# Altium schematic sheet Power.SchDoc
size A4; SheetNumber: 2; SheetTotal: 7
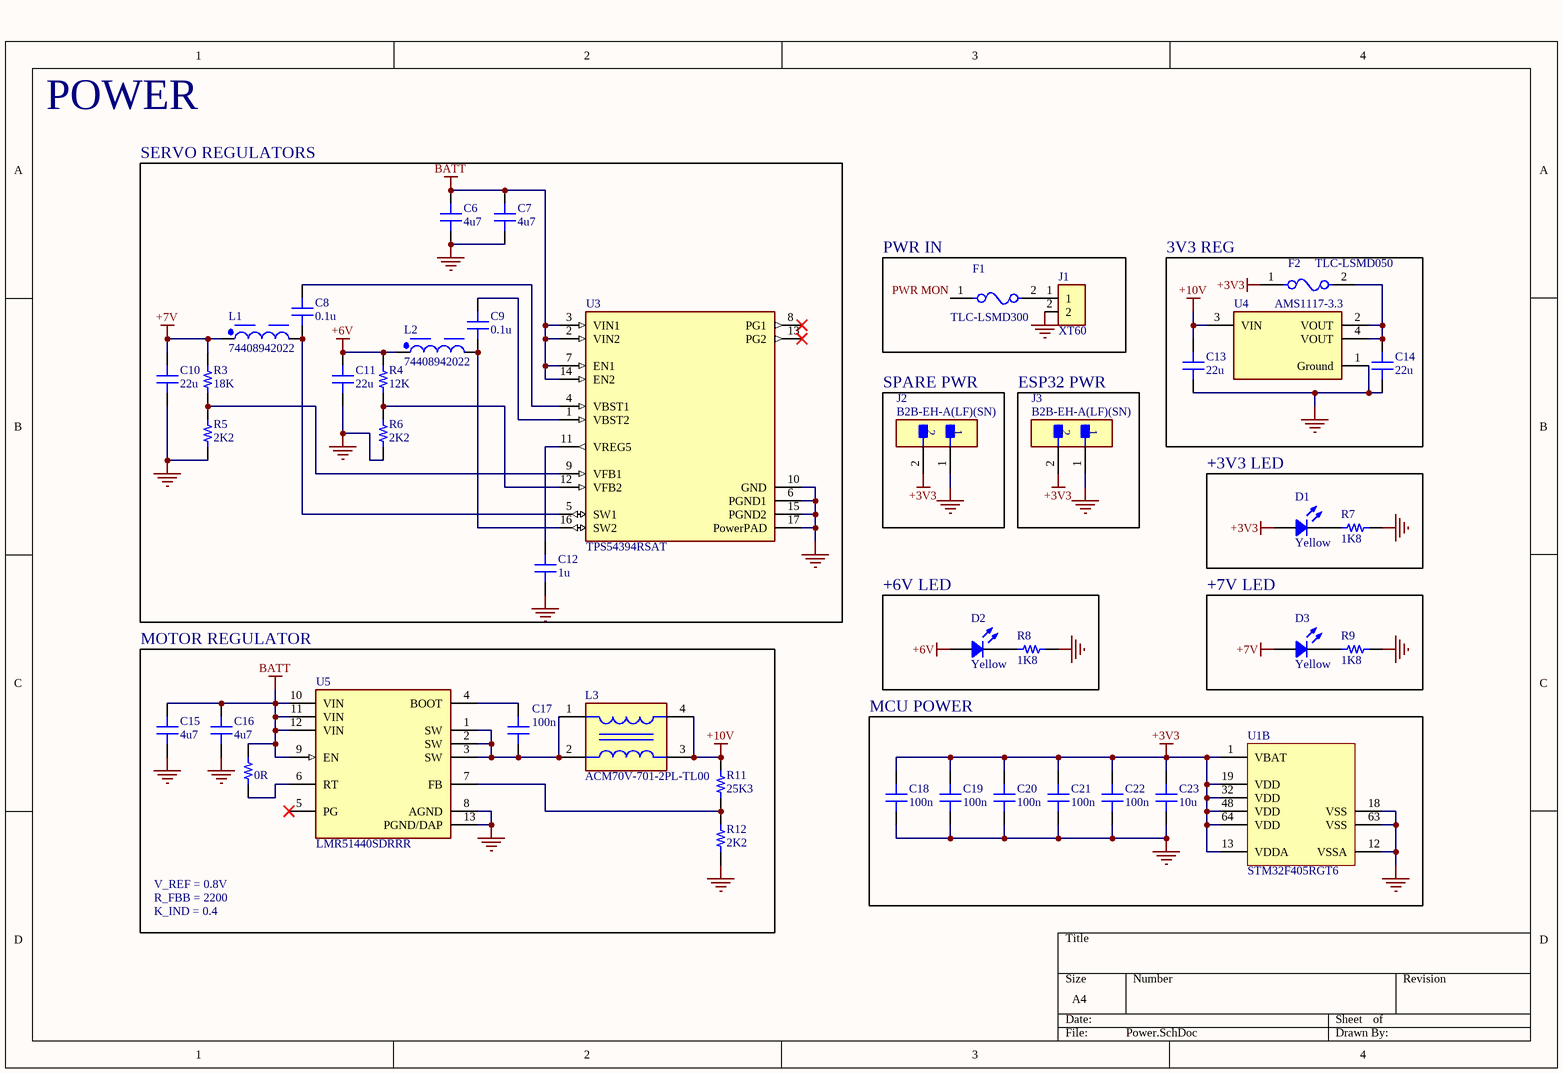
[diagram p0: Power.SchDoc]

## Parts
?  0R  [RES 0402_1005]
C6  4u7  [CAP 0805_2012]
C7  4u7  [CAP 0805_2012]
C8  0.1u  [CAP 0805_2012]
C9  0.1u  [CAP 0805_2012]
C10  22u  [CAP 0805_2012]
C11  22u  [CAP 0805_2012]
C12  1u  [CAP 0402_1005]
C13  22u  [CAP 0603_1608]
C14  22u  [CAP 0603_1608]
C15  4u7  [CAP 0805_2012]
C16  4u7  [CAP 0805_2012]
C17  100n  [CAP 0402_1005]
C18  100n  [CAP 0402_1005]
C19  100n  [CAP 0402_1005]
C20  100n  [CAP 0402_1005]
C21  100n  [CAP 0402_1005]
C22  100n  [CAP 0402_1005]
C23  10u  [CAP 0603_1608]
D1  Yellow  [LED 1206_3216 YELLOW]
D2  Yellow  [LED 1206_3216 YELLOW]
D3  Yellow  [LED 1206_3216 YELLOW]
F1  TLC-LSMD300  [FP-2920L-MFG]
F2  TLC-LSMD050  [FP-2920L-MFG]
J1  XT60  [AMASS_XT60PB-M]
J2  B2B-EH-A(LF)(SN)  [FP-B2B-EH-A_LF_SN-MFG]
J3  B2B-EH-A(LF)(SN)  [FP-B2B-EH-A_LF_SN-MFG]
L1  74408942022  [WE-SPC_4828]
L2  74408942022  [WE-SPC_4828]
L3  ACM70V-701-2PL-TL00  [FP-ACM70V-MFG]
R3  18K  [RES 0805_2012]
R4  12K  [RES 0805_2012]
R5  2K2  [RES 0805_2012]
R6  2K2  [RES 0805_2012]
R7  1K8  [RES 0402_1005]
R8  1K8  [RES 0402_1005]
R9  1K8  [RES 0402_1005]
R11  25K3  [RES 0805_2012]
R12  2K2  [RES 0805_2012]
U1  STM32F405RGT6  [STM-LQFP64_M]  (part B of 2)
U3  TPS54394RSAT  [FP-RSA0016B-IPC_B]
U4  AMS1117-3.3  [FP-AMS1117-IPC_C]
U5  LMR51440SDRRR  [FP-DRR0012G-IPC_A]

## Blocks framed on the sheet
SERVO REGULATORS: C6-C12 L1 L2 R3-R6 U3
PWR IN: F1 J1
3V3 REG: C13 C14 F2 U4
SPARE PWR: J2
ESP32 PWR: J3
+3V3 LED: D1 R7
+6V LED: D2 R8
+7V LED: D3 R9
MOTOR REGULATOR: ? C15-C17 L3 R11 R12 U5
MCU POWER: C18-C23 U1

## Nets
+3V3: C18.2 C19.2 C20.2 C21.2 C22.2 C23.2 D1.1 F2.1 J2.2 J3.2 U1.1(VBAT) U1.13(VDDA) U1.19(VDD) U1.32(VDD) U1.48(VDD) U1.64(VDD)
+6V: C11.2 D2.1 L2.1 R4.2
+7V: C10.2 D3.1 L1.1 R3.2
+10V: C13.2 L3.3 L3.4 R11.2 U4.3(VIN)
BATT: ?.2 C6.2 C7.2 C15.2 C16.2 U3.2(VIN2) U3.3(VIN1) U3.7(EN1) U3.14(EN2) U5.9(EN) U5.10(VIN) U5.11(VIN) U5.12(VIN)
GND: C6.1 C7.1 C10.1 C11.1 C12.1 C13.1 C14.1 C15.1 C16.1 C18.1 C19.1 C20.1 C21.1 C22.1 C23.1 J1.2 J2.1 J3.1 R5.1 R6.1 R7.2 R8.2 R9.2 R12.1 U1.12(VSSA) U1.18(VSS) U1.63(VSS) U3.6(PGND1) U3.10(GND) U3.15(PGND2) U3.17(PowerPAD) U4.1(Ground) U5.8(AGND) U5.13(PGND/DAP)
PWR MON: F1.1
Net?_1: ?.1 U5.6(RT)
NetC8_1: C8.1 L1.2 U3.5(SW1)
NetC8_2: C8.2 U3.4(VBST1)
NetC9_1: C9.1 L2.2 U3.16(SW2)
NetC9_2: C9.2 U3.1(VBST2)
NetC12_2: C12.2 U3.11(VREG5)
NetC14_2: C14.2 F2.2 U4.2(VOUT) U4.4(VOUT)
NetC17_1: C17.1 L3.1 L3.2 U5.1(SW) U5.2(SW) U5.3(SW)
NetC17_2: C17.2 U5.4(BOOT)
NetD1_2: D1.2 R7.1
NetD2_2: D2.2 R8.1
NetD3_2: D3.2 R9.1
NetF1_2: F1.2 J1.1
NetR3_1: R3.1 R5.2 U3.9(VFB1)
NetR4_1: R4.1 R6.2 U3.12(VFB2)
NetR11_1: R11.1 R12.2 U5.7(FB)

Not connected (* = marked no-connect by the designer): U3 8(PG1)* 13(PG2)*; U5 5(PG)*

## Notes on the sheet
- POWER
- V_REF = 0.8V
- R_FBB = 2200
- K_IND = 0.4

## Library data of the parts
? = 5112: 0402 JUMPER ON TAPE AND REEL; Part Number: 5112
C6-C11 C15 C16 = CBR08C330JAGAC: CAP CER 33PF 250V C0G/NP0 0805; manufacturer: KEMET; Temperature Coefficient: C0G, NP0; Tolerance: ±5%; Part Number: CBR08C330JAGAC; Applications: RF, Microwave, High Frequency; Capacitance: 33 pF; componentlink1description: Datasheet; componentlink1url: https://api.kemet.com/component-edge/download/datasheet/CBR08C330JAGAC.pdf; componentlink2description: DigiKey Link; componentlink2url: https://www.digikey.com/en/products/detail/kemet/CBR08C330JAGAC/2732330; Device Package: 0805 (2012 Metric); Features: High Q, Low Loss, Ultra Low ESR; lastupdated: 8/02/2024 8:16:33 PM; Lifecycle Status: Active; Minimum Order: 1; Mounting Type: Surface Mount, MLCC; Operating Temperature: -55°C ~ 125°C; Package / Case: 0805 (2012 Metric); packaging: TapeAndReel; partid: 2409; Part Status: Active; price: 0.36; series: CBR-SMD RF C0G; Size / Dimension: 0.079" L x 0.049" W (2.00mm x 1.25mm); Supplier 1: DigiKey; Supplier Part Number 1: 399-6202-1-ND; Thickness (Max): 0.037" (0.95mm); Voltage - Rated: 250V
  C6 C7 C15 C16: Value: 4u7
  C8 C9: Value: 0.1u
  C10 C11: Value: 22u
C12 C17-C22 = CL05B104KP5VPNC: CAP CER 100NF 10V X7R 0402; manufacturer: Samsung Electro-Mechanics; Capacitance: 0.1 µF; Tolerance: ±10%; Part Number: CL05B104KP5VPNC; Applications: Automotive; componentlink1description: Datasheet; componentlink1url: https://mm.digikey.com/Volume0/opasdata/d220001/medias/docus/5458/CL05B104KP5VPNC_Spec.pdf; componentlink2description: DigiKey Link; componentlink2url: https://www.digikey.com/en/products/detail/samsung-electro-mechanics/CL05B104KP5VPNC/20498482; Device Package: 0402 (1005 Metric); lastupdated: 29/01/2024 8:03:07 PM; Lifecycle Status: Active; Minimum Order: 1; Mounting Type: Surface Mount, MLCC; Operating Temperature: -55°C ~ 125°C; Package / Case: 0402 (1005 Metric); packaging: TapeAndReel; partid: 56690; price: 0.01; Ratings: AEC-Q200; series: CL; Size / Dimension: 0.039" L x 0.020" W (1.00mm x 0.50mm); Supplier 1: DigiKey; Supplier Part Number 1: 1276-CL05B104KP5VPNCCT-ND; Temperature Coefficient: X7R; Thickness (Max): 0.022" (0.55mm); Voltage - Rated: 10V
  C12: Value: 1u
  C17-C22: Value: 100n
C13 C14 = CL10A226MPCNUBE: CAP CER 22UF 10V X5R 0603; Part Number: CL10A226MPCNUBE
C23 = GRM188R60J106ME47D: CAP CER 10UF 6.3V X5R 0603; manufacturer: Murata Electronics; Capacitance: 10 µF; Tolerance: ±20%; Part Number: GRM188R60J106ME47D; Value: 10u; Applications: General Purpose; componentlink1description: Datasheet; componentlink1url: https://www.murata.com/~/media/webrenewal/support/library/catalog/products/capacitor/mlcc/c02e.ashx?la=en-us; componentlink2description: DigiKey Link; componentlink2url: https://www.digikey.com/en/products/detail/murata-electronics/GRM188R60J106ME47D/965910; Device Package: 0603 (1608 Metric); lastupdated: 29/01/2024 8:10:03 PM; Lifecycle Status: Active; Minimum Order: 1; Mounting Type: Surface Mount, MLCC; Operating Temperature: -55°C ~ 85°C; Package / Case: 0603 (1608 Metric); packaging: TapeAndReel; partid: 2351; Part Status: Active; price: 0.02; series: GRM; Size / Dimension: 0.063" L x 0.031" W (1.60mm x 0.80mm); Supplier 1: DigiKey; Supplier Part Number 1: 490-3896-1-ND; Temperature Coefficient: X5R; Thickness (Max): 0.035" (0.90mm); Voltage - Rated: 6.3V
D1-D3 = 5990240007F: LED YELLOW 1206 SMD; Manufacturer: Dialight; Configuration: Standard; Current - Test: 20mA; Lens Color: 0.80mm; Lens Size: 2.00mm x 1.60mm; Lens Style: Rectangle with Flat Top; Millicandela Rating: 126mcd; Viewing Angle: 140°; Voltage - Forward (Vf) (Typ): 2.1V; Wavelength - Dominant: 590nm; Part Number: 5990240007F; Color: Yellow; ComponentLink1Description: Datasheet; ComponentLink1URL: http://www.dialightsignalsandcomponents.com/Assets/Brochures_And_Catalogs/Indication/CBI_SMD_new/Dialight_CBI_data_599-1206_Apr2018.pdf; ComponentLink2Description: DigiKey Link; ComponentLink2URL: https://www.digikey.com/en/products/detail/dialight/5990240007F/9385418; Device Package: 1206 (3216 Metric); Height (Max): 0.80mm; LastUpdated: 27/01/2024 9:27:52 PM; Lifecycle Status: Active; Minimum Order: 1; Mounting Type: Surface Mount; Package / Case: 1206 (3216 Metric); Packaging: TapeAndReel; PartId: 1; Part Status: Active; Price: 0.04; Series: 599; Size / Dimension: 3.20mm L x 1.60mm W; Supplier 1: DigiKey; Supplier Part Number 1: 350-4363-1-ND; Supplier Device Package: 1206; Value: Yellow
F1 F2 = CMP-2000-05550-2: PTC RESET FUSE 15V 3A 2920; Manufacturer: Littelfuse; Manufacturer Part Number: 2920L300/15DR; Current Rating: 40A; Trip Current: 5A; Trip Time: 20s; Resistance: 0.015-0.048Ω; Value: 0.015-0.048Ω; Device Class L3: unset; Temperature: -40°C to +85°C; ComponentLink2Description: Datasheet; Temperature Range High: +85°C; Digikey Description: PTC RESET FUSE 15V 3A 2920; Lead Free: Yes; Height: 1.25mm; Voltage Rating: 15V; Package: 2920L; Temperature Range Low: -40°C; Ambient Temperature Range High: +85°C; RoHS: TRUE; Ambient Temperature Range Low: -40°C; Device Class L2: PTC Resettable Fuses; Category: Fuse; Automotive: No; ComponentLink2URL: https://m.littelfuse.com/~/media/electronics/datasheets/resettable_ptcs/littelfuse_ptc_2920l_datasheet.pdf.pdf; Device Class L1: Circuit Protection; Hold Current: 3A; Octopart: https://octopart.com/2920l300%2F15dr-littelfuse-673797
J1 = XT60_YELLOW: Power connector; 65A; PIN: 2; Colour: yellow; MP: XT60 YELLOW; MF: Pololu; SnapEDA_Link: https://www.snapeda.com/parts/XT60%20YELLOW/Pololu/view-part/?ref=snap; Availability: Not in stock; Package: None; Check_prices: https://www.snapeda.com/parts/XT60%20YELLOW/Pololu/view-part/?ref=eda; Value: *; Price: None
J2 J3 = CMP-17439-000026-1: CONN HEADER VERT 2POS 2.5MM; Number of Contacts: 2; Current Rating: 3A; Connector Type: Plug; Contact Resistance: 20mR; Gender: Male; Voltage Rating: 250V; Fastening Type: Detent; Depth: 3.8mm; Max Operating Temperature: 85°C; Orientation: Straight; Series: EH; Contact Plating: Tin; Min Operating Temperature: -25°C; Contact Type: Male Pin; Housing Color: White; Termination: Press-Fit; Housing Material: Nylon; Pitch: 2.5mm; Number of Positions: 2; Max Current Rating: 3A; Packaging: Bulk; Lead Free: Lead Free; Number of Rows: 1; Length: 7.5mm; Contact Mating Length: 0.13inch; Color: Natural; Max Voltage Rating (AC): 250V; Contact Material: Copper Alloy; Mount: Through Hole
L1 L2 = CMP-1401-00021-2: NexarPartId: 23392467; Self Resonant Frequency: 54MHz; RMS Current (Irms): 2.5A; Shielding: Shielded; Test Frequency: 100kHz; Max DC Current: 4A; Inductance: 2.2µH; DC Resistance (DCR): 38mΩ; Core Material: Ferrite; Inductance Tolerance: 20%; Case/Package: 4828; Case Code (Metric): 4848; Length: 4.8mm; Mount: Surface Mount; Max Operating Temperature: 125°C; Ambient Temperature Range High: 85°C; Case Code (Imperial): 1919; Ambient Temperature Range Low: -40°C; Number of Pins: 2; Current Rating: 2.5A; REACH SVHC: Unknown; Height: 2.8mm; Saturation Current: 4A; Width: 4.8mm; RoHS: Compliant; Termination: SMD/SMT; Tolerance: 20%; Min Operating Temperature: -40°C; Packaging: Digi-Reel®
L3 = CMP-08256-000005-1: CMC 4A 2LN 700 OHM SMD AEC-Q200; Manufacturer: TDK; Automotive Grade: Grade 1; Series Resistance: 15mΩ; Shielding: true; Impedance At Frequency: 700Ω @ 100MHz; Device Class L3: Common Mode Chokes; Temperature: -40°C to +125°C; Automotive: Yes; Mouser Description: Ind Common Mode Filter Shielded Wirewound 700Ohm 100MHz Ferrite 4A 7 X 6 X 3.5 Blister T/R; Height: 3.5mm; Digikey Description: CMC 4A 2LN 700 OHM SMD AEC-Q200; Manufacturer Part Number: ACM70V-701-2PL-TL00; Octopart: https://octopart.com/acm70v-701-2pl-tl00-tdk-9565115; Category: Filter; Lead Free: Yes; RoHS: TRUE; Temperature Range High: +125°C; Composition: Wirewound; Device Class L1: Passive Components; Device Class L2: EMI / RFI Components; ComponentLink2Description: Datasheet; Temperature Range Low: -40°C; Package: ACM70V; Rms Current: 4A; ComponentLink2URL: https://product.tdk.com/info/en/catalog/datasheets/cmf_automotive_power_acm70v_en.pdf
R3-R6 R11 R12 = TLRZ2ATTD: RES 0 OHM JUMPER 0805; Manufacturer: KOA Speer Electronics, Inc.; Resistance: 0 Ohms; Part Number: TLRZ2ATTD; ComponentLink1Description: Datasheet; ComponentLink1URL: http://www.koaspeer.com/catimages/Products/TLRZ/TLRZ.pdf; ComponentLink2Description: DigiKey Link; ComponentLink2URL: https://www.digikey.com/en/products/detail/koa-speer-electronics-inc/TLRZ2ATTD/9845494; Composition: Metal Element; Device Package: 0805 (2012 Metric); Features: Automotive AEC-Q200, Current Sense; Height - Seated (Max): 0.022" (0.55mm); LastUpdated: 8/02/2024 9:02:39 PM; Lifecycle Status: Active; Minimum Order: 1; Number of Terminations: 2; Operating Temperature: -55°C ~ 170°C; Package / Case: 0805 (2012 Metric); Packaging: TapeAndReel; PartId: 27685; Part Status: Active; Price: 0.08; Ratings: AEC-Q200; Series: TLRZ; Size / Dimension: 0.079" L x 0.049" W (2.00mm x 1.25mm); Supplier 1: DigiKey; Supplier Part Number 1: 2019-TLRZ2ATTDCT-ND; Supplier Device Package: 0805; Tolerance: Jumper
  R3: Value: 18K
  R4: Value: 12K
  R5 R6 R12: Value: 2K2
  R11: Value: 25K3
R7-R9 = RP73PF1E10KBTD: RES 10K OHM 0.1% 1/10W 0402; Part Number: RP73PF1E10KBTD
U1 = CMP-0243-00019-3: ARM Cortex-M4 32-bit MCU+FPU, 210 DMIPS, 1024 kB Flash, 192 kB Internal RAM, 51 I/Os, 64-pin LQFP, -40 to 85 degC, Tray; Manufacturer: STMicroelectronics; Supply Voltage(Vcc) min (V): 1.8; Supply Voltage(Vcc) max (V): 3.6; Internal RAM Size (kB): 192; I/Os (High Current): 51; D/A Converter: 2x12-bit; FLASH Size (Prog) (kB): 1024; Operating Frequency(F) (Processor speed) (MHz): 168; ComponentLink2Description: Datasheet; PackageVersion: Rev. 4, 06/2013; DatasheetVersion: Rev. 4; Core: ARM Cortex-M4; ComponentLink2URL: http://www.st.com/st-web-ui/static/active/en/resource/technical/document/datasheet/DM00037051.pdf; PackageReference: LQFP64; Packing: Tray; ComponentLink1Description: Manufacturer URL; ComponentLink3URL: http://www.st.com/st-web-ui/static/active/en/resource/technical/document/datasheet/DM00037051.pdf; ComponentLink3Description: Package Specification; Mounting Technology: Surface Mount; ComponentLink1URL: http://www.st.com/web/en/home.html; PackageDescription: 64-Pin Low Profile Quad Flat Package, 10 x 10 mm Body, 0.5 mm Pitch; PartNumber: STM32F405RGT6
U3 = CMP-04918-000415-1: IC REG BUCK ADJ 3A DL 16QFN; Switching Frequency: 700kHz; Voltage - Output 1: 7V; Number of Outputs: 2; Min Supply Voltage: 4.5V; Output Configuration: Positive; Min Output Voltage: 760mV; Synchronous Rectifier: Yes; Quiescent Current: 1.2mA; Max Input Voltage: 18V; Output Type: Adjustable; Min Operating Temperature: -40°C; Case/Package: QFN; Lead Free: Lead Free; Package Quantity: 250; Packaging: Tape and Reel; Max Output Voltage: 7V; Current - Output 2: 3A; RoHS Compliant: Yes; Radiation Hardening: No; Max Operating Temperature: 85°C; Current - Output 1: 3A; REACH SVHC: No SVHC; Mount: Surface Mount; Voltage - Output 2: 7V; Min Input Voltage: 4.5V; Operating Supply Voltage: 18V; Number of Pins: 16; Output Voltage: 7V; Output Current: 3A
U4 = CMP-209535-000001-1: LDO Voltage Regulators 1A, 3.3V; Manufacturer: Advanced Monolithic Systems; Dropout Voltage: 1.1V; Output Type: Fixed; Nominal Supply Current: 5mA; Max Power Dissipation: 1.2W; Max Supply Voltage: 15V; Number Of Outputs: 1; Standoff Height: 0.64mm; Max Junction Temp: +125°C; Height: 1.8mm; Package: AMS1117; Device Class L2: Power Management ICs; ComponentLink2Description: Datasheet; ComponentLink2URL: http://www.advanced-monolithic.com/pdf/ds1117.pdf; Category: IC; RoHS: TRUE; Automotive: No; Device Class L1: Integrated Circuits (ICs); Output Current: 1A; Device Class L3: Voltage Regulators - Linear; Temperature: -40°C to +125°C; Output Voltage: 3.3V; Manufacturer Part Number: AMS1117-3.3; Temperature Range Low: -40°C; Octopart: https://octopart.com/ams1117-3.3-advanced+monolithic+systems-25899300; Lead Free: Yes; Ipc Land Pattern Name: SOT229P700X180-4; Temperature Range High: +125°C
U5 = CMP-00370-132508643-1: LMR51440SDRRR 36-V, 4-A synchronous buck converter 12-WSON -40 to 150; Manufacturer Lifecycle Status: ACTIVE; Max Junction Temperature (Tj): 150°C; Output Current: 4A; Number of Outputs: 1; Max Supply Voltage: 36V; Max Duty Cycle: 97%; Min Supply Voltage: 4V; Nominal Supply Current: 25µA; Width: 3mm; Min Operating Temperature: -40°C; Thickness: 750µm; Lifecycle Status: Production; Number of Pins: 12; NexarPartId: 132508643; Height: 800µm; Length: 3mm; Max Operating Temperature: 150°C